# Altium schematic sheet FPGA_IO_2.SchDoc
size A
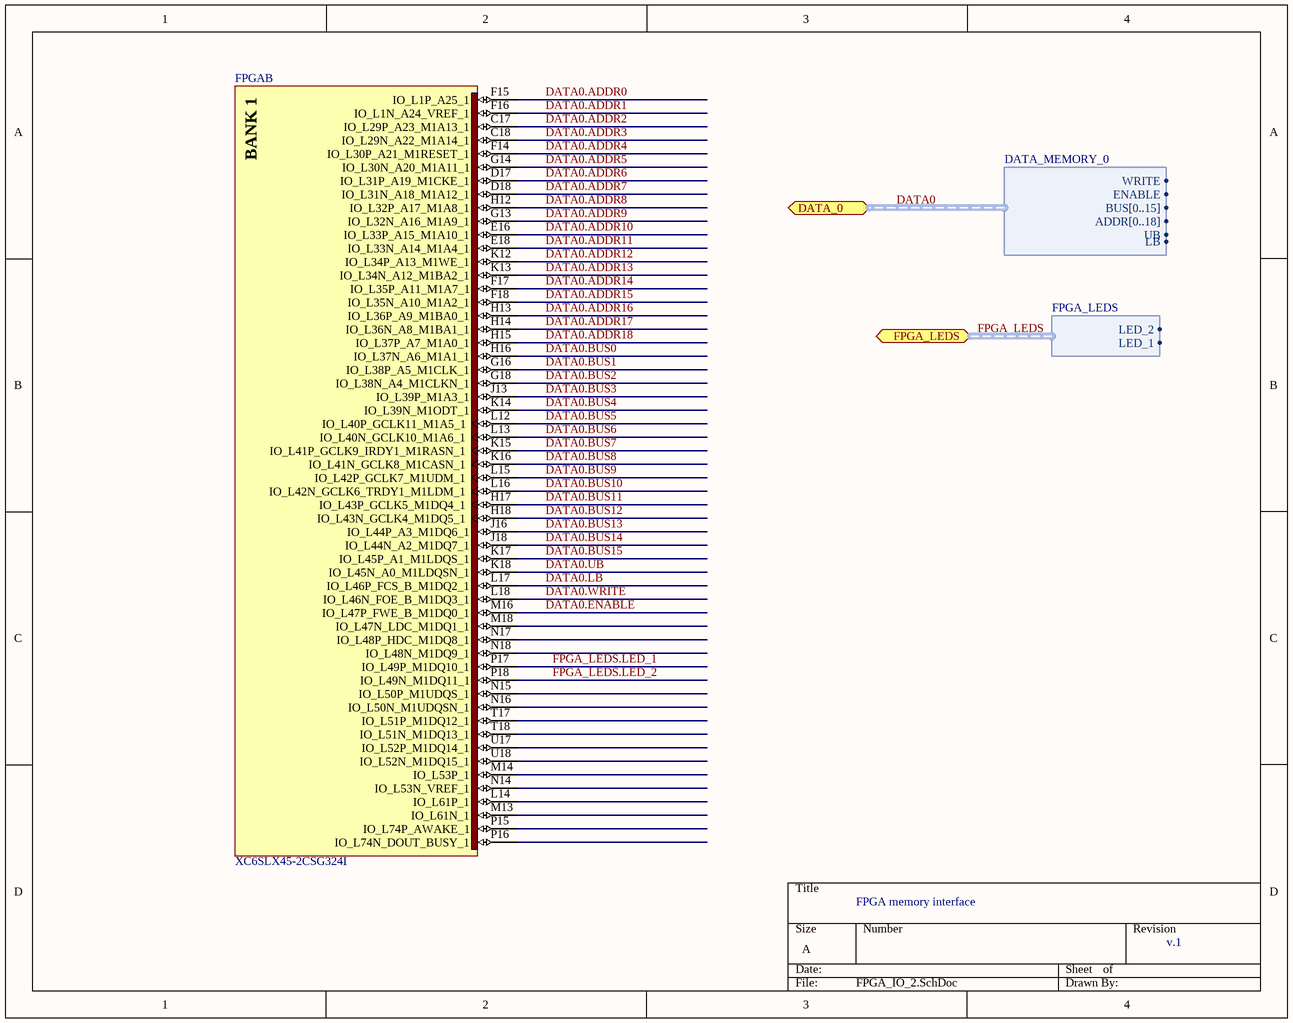
[diagram p0: FPGA_IO_2.SchDoc]

## Parts
FPGA  XC6SLX45-2CSG324I  [CSG324]  (part B of 8)

## Ports
DATA_0 (harness DATA_MEMORY_0), FPGA_LEDS (harness FPGA_LEDS)

## Harnesses
DATA_MEMORY_0: WRITE, ENABLE, BUS[0..15], ADDR[0..18], UB, LB
FPGA_LEDS: LED_1, LED_2

## Nets
DATA0.ADDR0: FPGA.F15(IO_L1P_A25_1)
DATA0.ADDR1: FPGA.F16(IO_L1N_A24_VREF_1)
DATA0.ADDR2: FPGA.C17(IO_L29P_A23_M1A13_1)
DATA0.ADDR3: FPGA.C18(IO_L29N_A22_M1A14_1)
DATA0.ADDR4: FPGA.F14(IO_L30P_A21_M1RESET_1)
DATA0.ADDR5: FPGA.G14(IO_L30N_A20_M1A11_1)
DATA0.ADDR6: FPGA.D17(IO_L31P_A19_M1CKE_1)
DATA0.ADDR7: FPGA.D18(IO_L31N_A18_M1A12_1)
DATA0.ADDR8: FPGA.H12(IO_L32P_A17_M1A8_1)
DATA0.ADDR9: FPGA.G13(IO_L32N_A16_M1A9_1)
DATA0.ADDR10: FPGA.E16(IO_L33P_A15_M1A10_1)
DATA0.ADDR11: FPGA.E18(IO_L33N_A14_M1A4_1)
DATA0.ADDR12: FPGA.K12(IO_L34P_A13_M1WE_1)
DATA0.ADDR13: FPGA.K13(IO_L34N_A12_M1BA2_1)
DATA0.ADDR14: FPGA.F17(IO_L35P_A11_M1A7_1)
DATA0.ADDR15: FPGA.F18(IO_L35N_A10_M1A2_1)
DATA0.ADDR16: FPGA.H13(IO_L36P_A9_M1BA0_1)
DATA0.ADDR17: FPGA.H14(IO_L36N_A8_M1BA1_1)
DATA0.ADDR18: FPGA.H15(IO_L37P_A7_M1A0_1)
DATA0.BUS0: FPGA.H16(IO_L37N_A6_M1A1_1)
DATA0.BUS1: FPGA.G16(IO_L38P_A5_M1CLK_1)
DATA0.BUS2: FPGA.G18(IO_L38N_A4_M1CLKN_1)
DATA0.BUS3: FPGA.J13(IO_L39P_M1A3_1)
DATA0.BUS4: FPGA.K14(IO_L39N_M1ODT_1)
DATA0.BUS5: FPGA.L12(IO_L40P_GCLK11_M1A5_1)
DATA0.BUS6: FPGA.L13(IO_L40N_GCLK10_M1A6_1)
DATA0.BUS7: FPGA.K15(IO_L41P_GCLK9_IRDY1_M1RASN_1)
DATA0.BUS8: FPGA.K16(IO_L41N_GCLK8_M1CASN_1)
DATA0.BUS9: FPGA.L15(IO_L42P_GCLK7_M1UDM_1)
DATA0.BUS10: FPGA.L16(IO_L42N_GCLK6_TRDY1_M1LDM_1)
DATA0.BUS11: FPGA.H17(IO_L43P_GCLK5_M1DQ4_1)
DATA0.BUS12: FPGA.H18(IO_L43N_GCLK4_M1DQ5_1)
DATA0.BUS13: FPGA.J16(IO_L44P_A3_M1DQ6_1)
DATA0.BUS14: FPGA.J18(IO_L44N_A2_M1DQ7_1)
DATA0.BUS15: FPGA.K17(IO_L45P_A1_M1LDQS_1)
DATA0.ENABLE: FPGA.M16(IO_L47P_FWE_B_M1DQ0_1)
DATA0.LB: FPGA.L17(IO_L46P_FCS_B_M1DQ2_1)
DATA0.UB: FPGA.K18(IO_L45N_A0_M1LDQSN_1)
DATA0.WRITE: FPGA.L18(IO_L46N_FOE_B_M1DQ3_1)
FPGA_LEDS.LED_1: FPGA.P17(IO_L49P_M1DQ10_1)
FPGA_LEDS.LED_2: FPGA.P18(IO_L49N_M1DQ11_1)

Not connected (* = marked no-connect by the designer): FPGA L14(IO_L61P_1) M13(IO_L61N_1) M14(IO_L53P_1) M18(IO_L47N_LDC_M1DQ1_1) N14(IO_L53N_VREF_1) N15(IO_L50P_M1UDQS_1) N16(IO_L50N_M1UDQSN_1) N17(IO_L48P_HDC_M1DQ8_1) N18(IO_L48N_M1DQ9_1) P15(IO_L74P_AWAKE_1) P16(IO_L74N_DOUT_BUSY_1) T17(IO_L51P_M1DQ12_1) T18(IO_L51N_M1DQ13_1) U17(IO_L52P_M1DQ14_1) U18(IO_L52N_M1DQ15_1)

## Buses and harness runs
harness DATA0 = port DATA_0
harness FPGA_LEDS = port FPGA_LEDS

## Notes on the sheet
- FPGA memory interface
- v.1
- (in symbol CMP-0067-00402-1, part B) BANK 1

## Library data of the parts
FPGA = CMP-0067-00402-1: Spartan-6 LX 1.2V FPGA, 218 User I/Os, 324-Ball Chip-Scale BGA (0.8mm Pitch), Speed Grade 2, Industrial Grade, Pb-Free; Code_JEDEC: MO-275-KKAC-1; PackageDescription: 324-Ball Chip-Scale BGA (CSG324) Package, 0.8 mm Pitch; DatasheetVersion: ver1.6, Nov-2010; PackageVersion: ver1.1, Nov-2009; PackageReference: CSG324